# EAGLE schematic main (EAGLE 9.6.2)
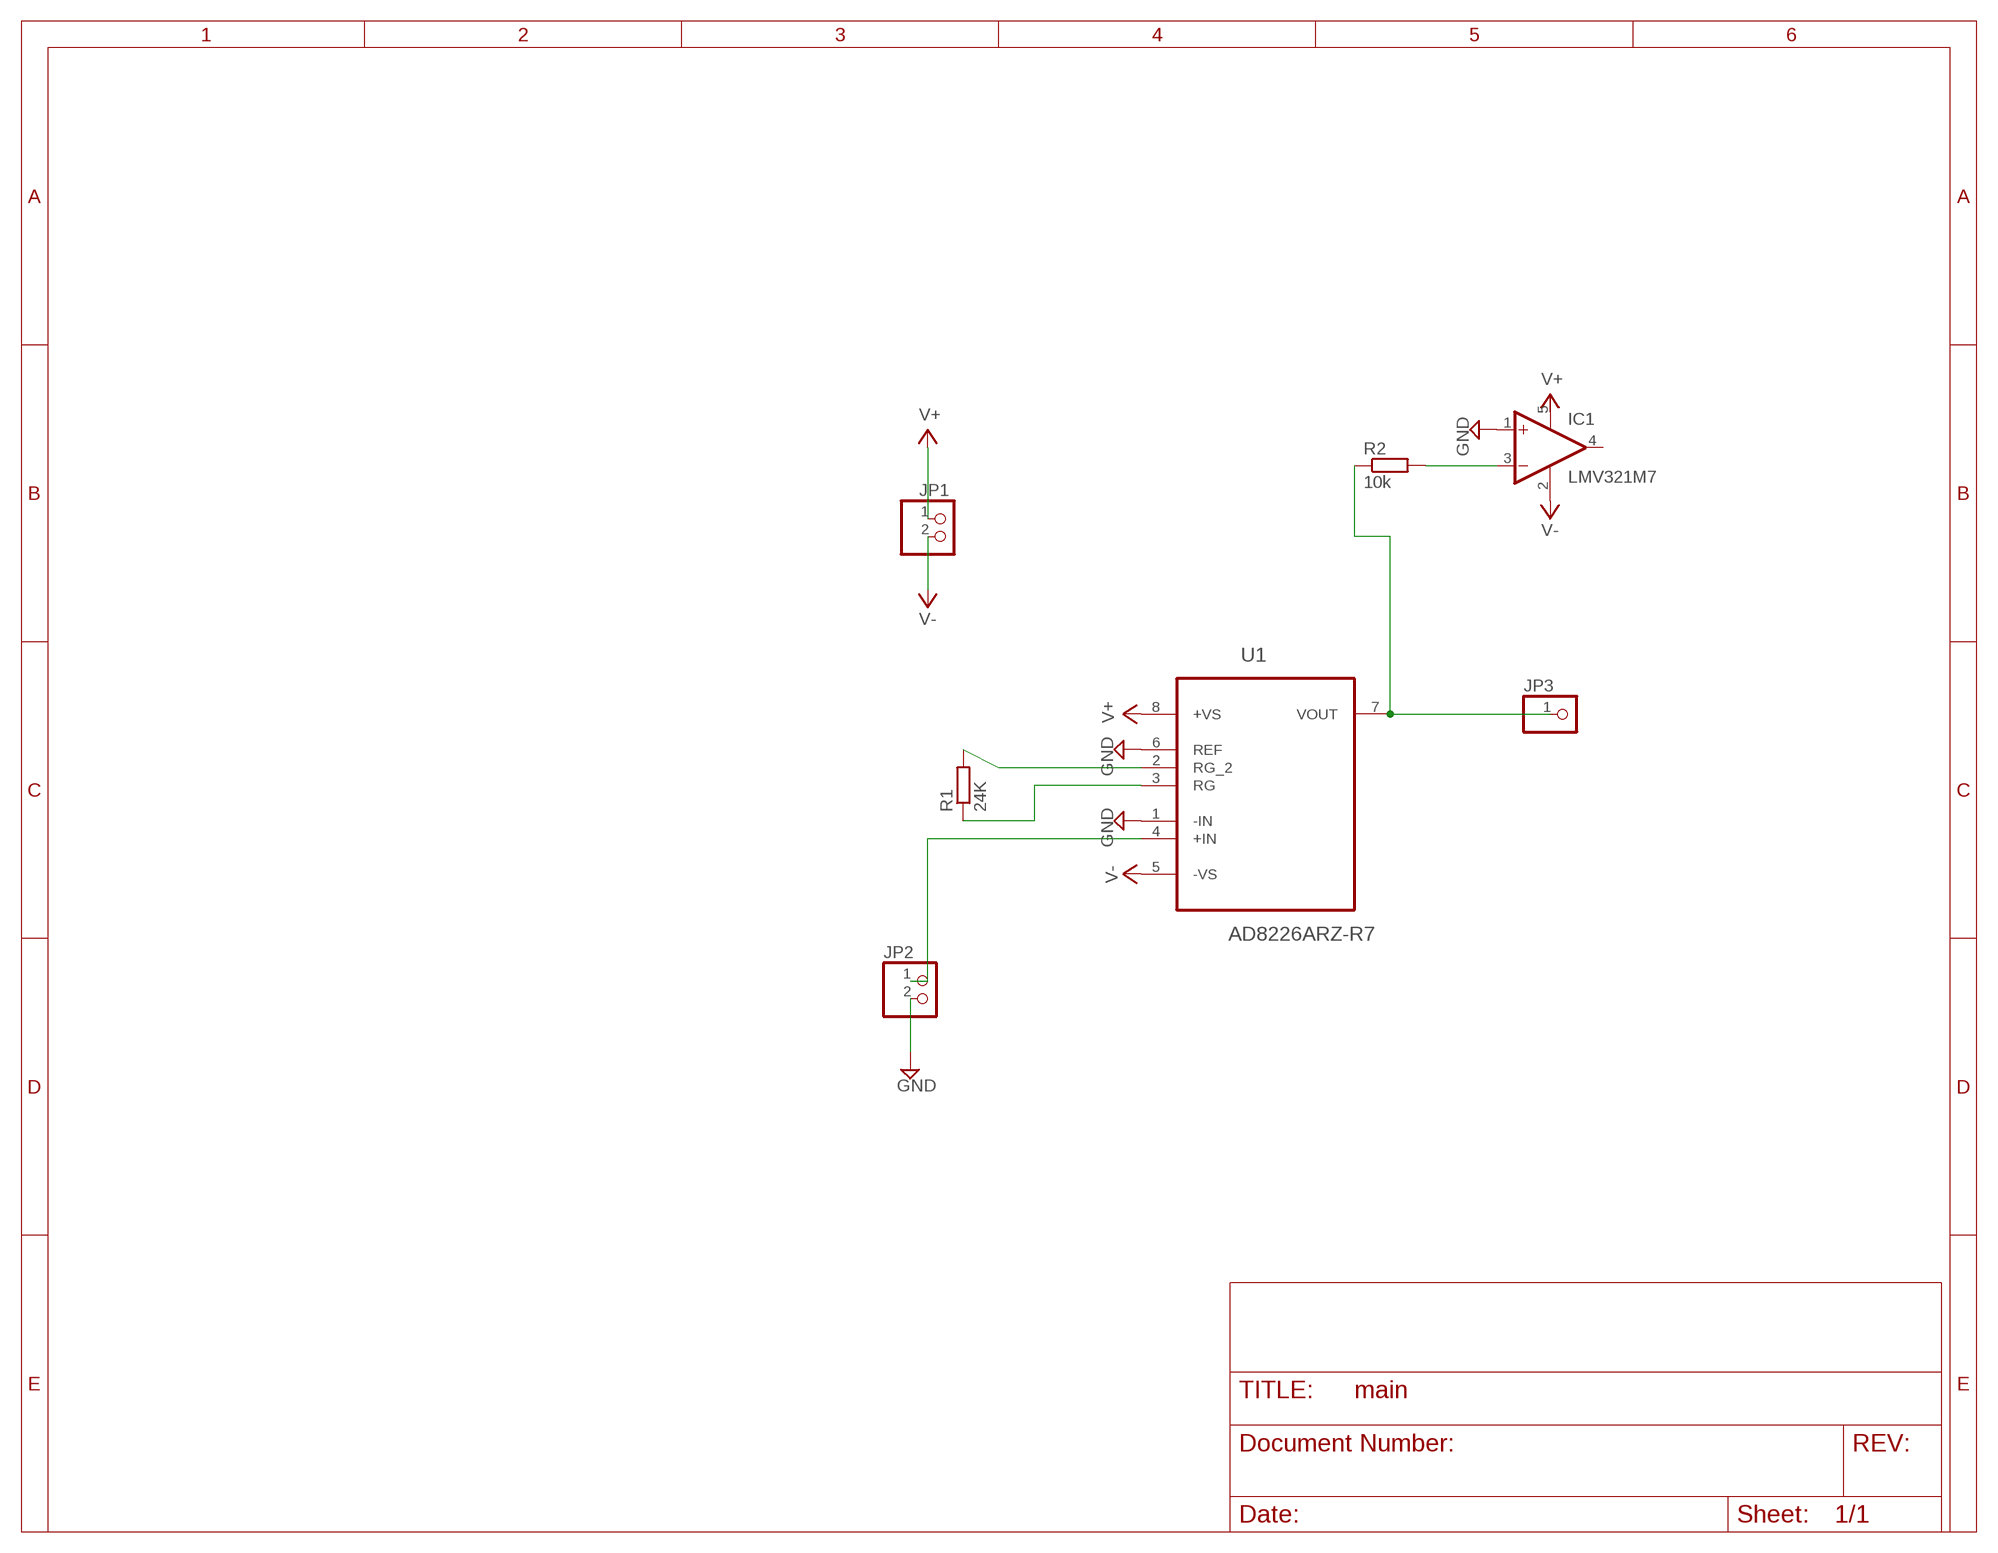
[diagram p0: schematic, sheet 1]

## Parts
IC1  LMV321M7  [SC70-5L]
JP1  PINHD-1X2  [1X02]
JP2  PINHD-1X2  [1X02]
JP3  PINHD-1X1  [1X01]
R1  24K  R-EU_R0805  [R0805]
R2  10k  R-EU_R0805  [R0805]
U1  AD8226ARZ-R7  [SOIC127P600X175-8N]

## Nets
GND: IC1.1(+IN) JP2.2 U1.1(-IN) U1.6(REF)
N$1: R1.2 U1.2(RG_2)
N$2: R1.1 U1.3(RG)
N$3: JP2.1 U1.4(+IN)
N$4: IC1.3(-IN) R2.2
N$5: JP3.1 R2.1 U1.7(VOUT)
V+: JP1.1 U1.8(+VS)
V-: IC1.2(V-) JP1.2 U1.5(-VS)
Unconnected: IC1.4(OUT)

## Power pins joined to a net without a drawn wire
V+: IC1.5(V+)

## Library data of the parts
IC1 = LMV321__:LMV321?*: General Purpose, Low Voltage, Rail-to-Rail Output Operational Amplifiers Source: http://www.national.com/mpf/LM/LMV321.html http://www.national.com/dt/lmv_qual.pdf Check availability <https://pricing.snapeda.com/parts/LMV321/STMicroelectronics/view-part?ref=eda>; AVAILABILITY: Not in stock; DESCRIPTION: General Purpose Amplifier 1 Circuit Rail-to-Rail SOT-23-5; MF: STMicroelectronics; MP: LMV321; PACKAGE: SOT-23-5 STMicroelectronics; PRICE: None
JP1 JP2 = pinhead:PINHD-1X2: PIN HEADER
JP3 = pinhead:PINHD-1X1: PIN HEADER
R1 R2 = rcl:R-EU_: RESISTOR, European symbol; SPICEPREFIX: R
U1 = Analog Devices_By_element14_Batch_1:AD8226ARZ-R7: Wide Supply Range, Rail-to-Rail Output Instrumentation Amplifier; MPN: AD8226ARZ-R7; OC_FARNELL: -; OC_NEWARK: 71P7872; PACKAGE: SOIC-8; SUPPLIER: Analog Devices